# EAGLE design M163X (EAGLE 6.6.0)
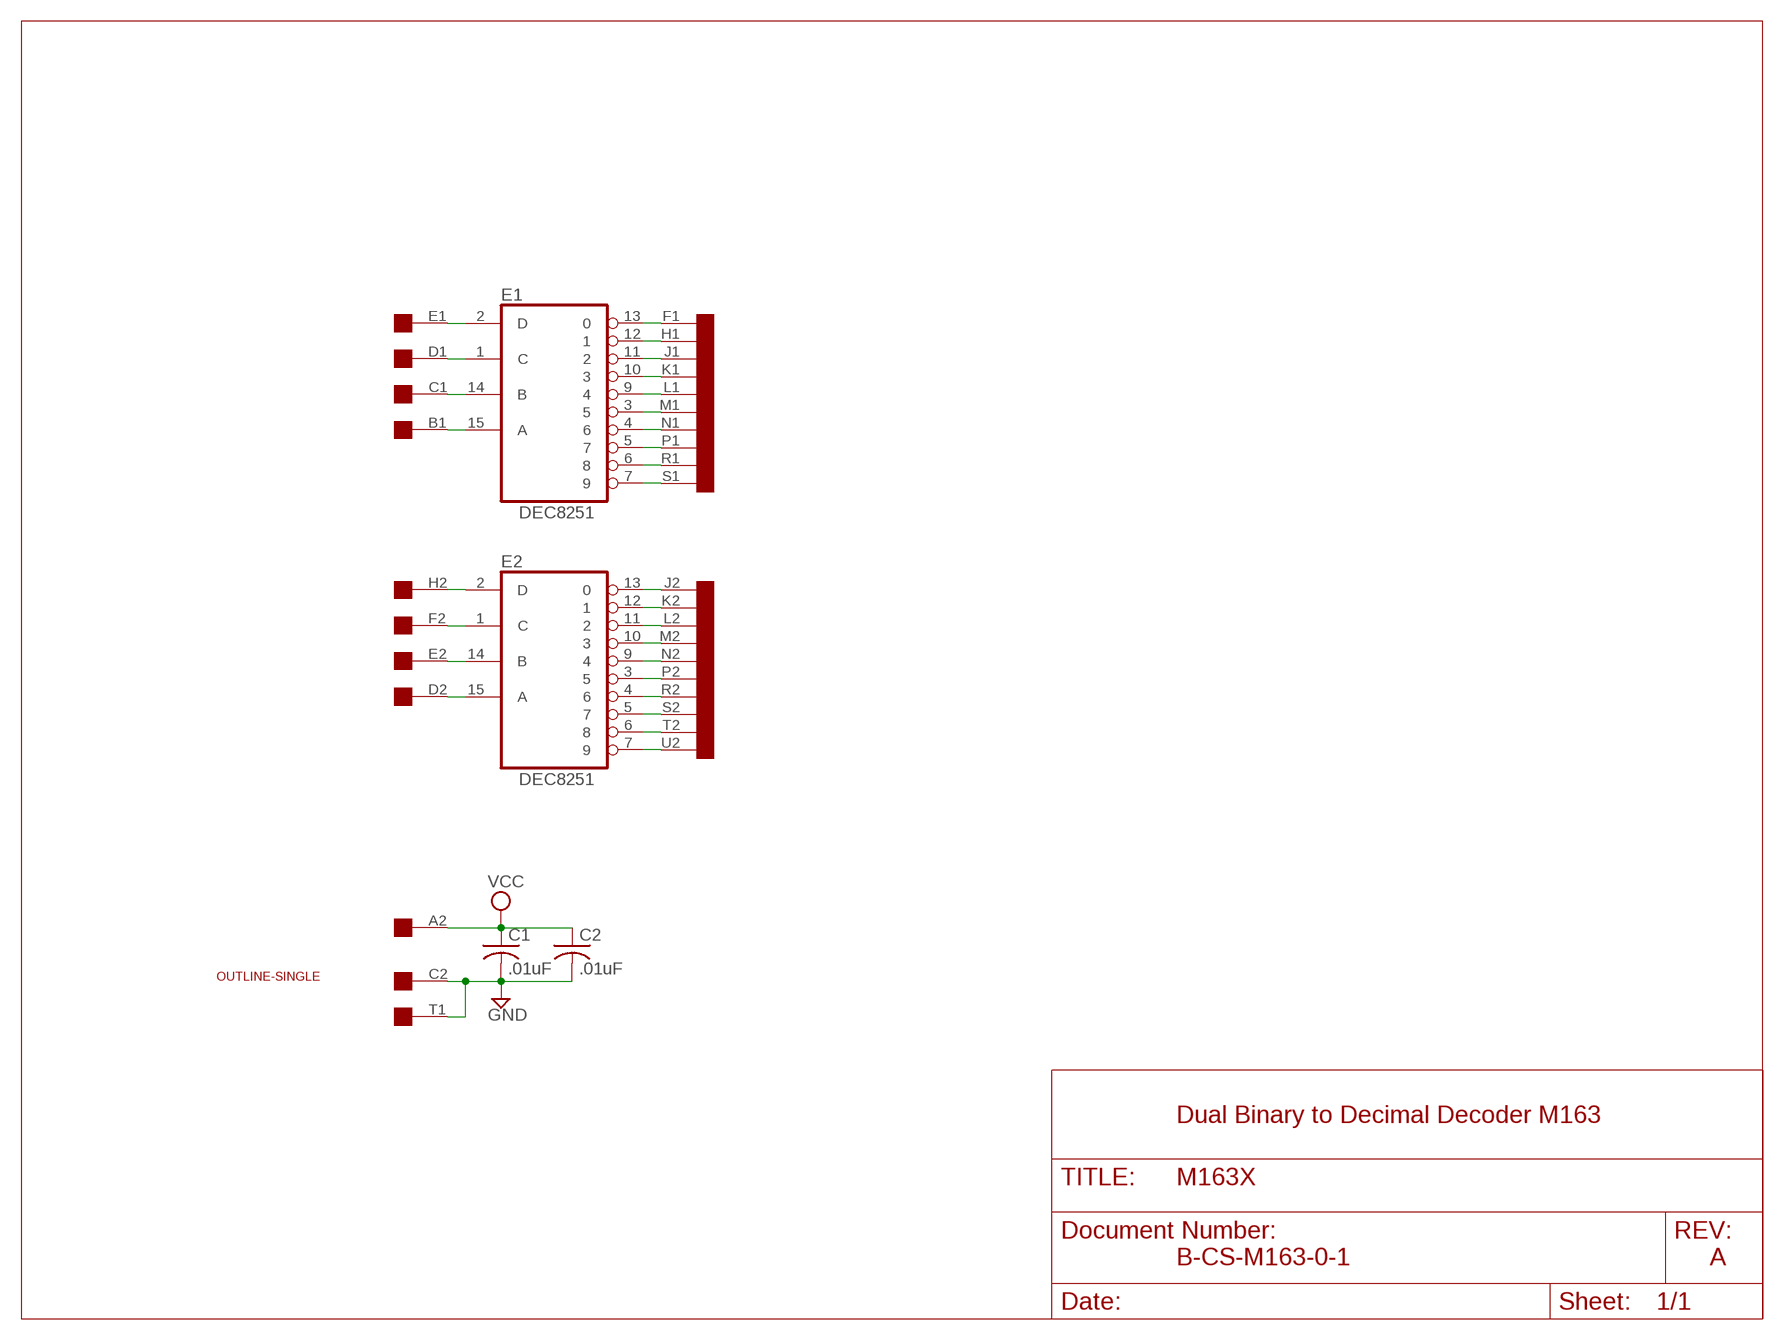
[diagram p0: schematic, sheet 1]

## Parts
C1  .01uF  C-US050-025X075  [C050-025X075]
C2  .01uF  C-US050-025X075  [C050-025X075]
E1  DEC8251  [DIL16]
E2  DEC8251  [DIL16]
U$1  OUTLINE-SINGLE  [SINGLE]
U$2  SINGLE  [EDGE-CON2]

## Nets
GND [supply]: C1.2 C2.2 U$2.C2 U$2.T1
N$1: E1.15(A) U$2.B1
N$2: E1.14(B) U$2.C1
N$3: E1.1(C) U$2.D1
N$4: E1.2(D) U$2.E1
N$5: E1.13 U$2.F1
N$6: E1.12 U$2.H1
N$7: E1.11 U$2.J1
N$8: E1.10 U$2.K1
N$9: E1.3 U$2.M1
N$10: E1.9 U$2.L1
N$11: E1.4 U$2.N1
N$12: E1.5 U$2.P1
N$13: E1.6 U$2.R1
N$14: E1.7 U$2.S1
N$15: E2.2(D) U$2.H2
N$16: E2.1(C) U$2.F2
N$17: E2.15(A) U$2.D2
N$18: E2.14(B) U$2.E2
N$19: E2.11 U$2.L2
N$20: E2.10 U$2.M2
N$21: E2.9 U$2.N2
N$22: E2.3 U$2.P2
N$23: E2.4 U$2.R2
N$24: E2.5 U$2.S2
N$25: E2.6 U$2.T2
N$26: E2.12 U$2.K2
N$27: E2.13 U$2.J2
N$28 [supply]: E2.7 U$2.U2
VCC [supply]: C1.1 C2.1 U$2.A2
Unconnected: U$2.A1 U$2.B2 U$2.U1 U$2.V1 U$2.V2

## Notes on the sheet
- Dual Binary to Decimal Decoder M163
- B-CS-M163-0-1 | A

## Power pins joined to a net without a drawn wire
GND: E1.8(GND) E2.8(GND)
VCC: E1.16(VCC) E2.16(VCC)

## Library data of the parts
C1 C2 = rcl:C-US: CAPACITOR, American symbol
E1 E2 = dec-con:DEC8251: BCD Decoder
U$1 = dec-con:OUTLINE-*: Board outlines for DEC boards.
U$2 = dec-con:SINGLE: Single-Height DEC board

## Net classes
1 supply: width 0.813 mm

## Board
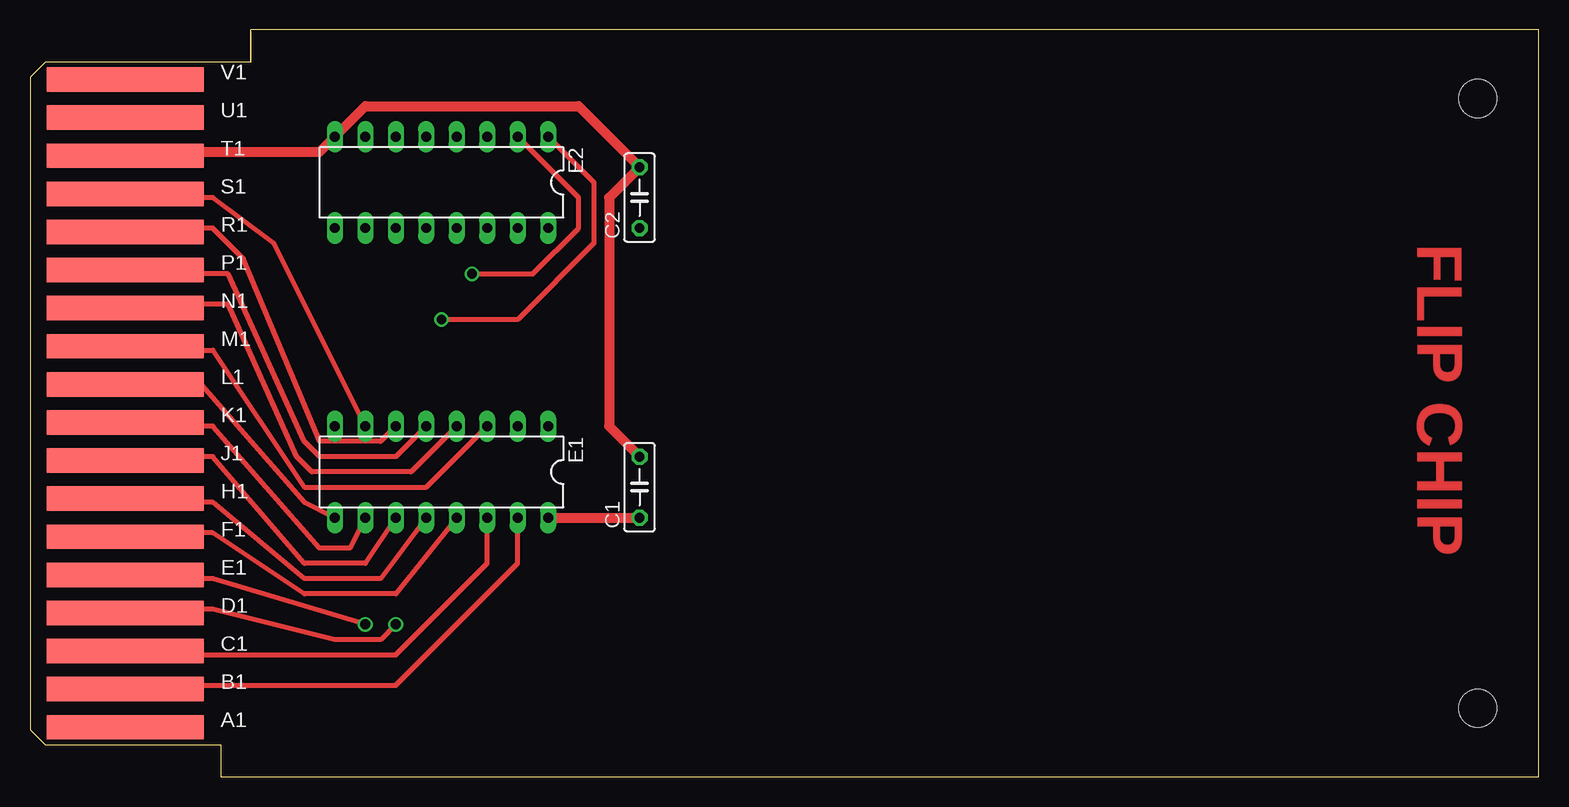
[diagram p1: board, top side]
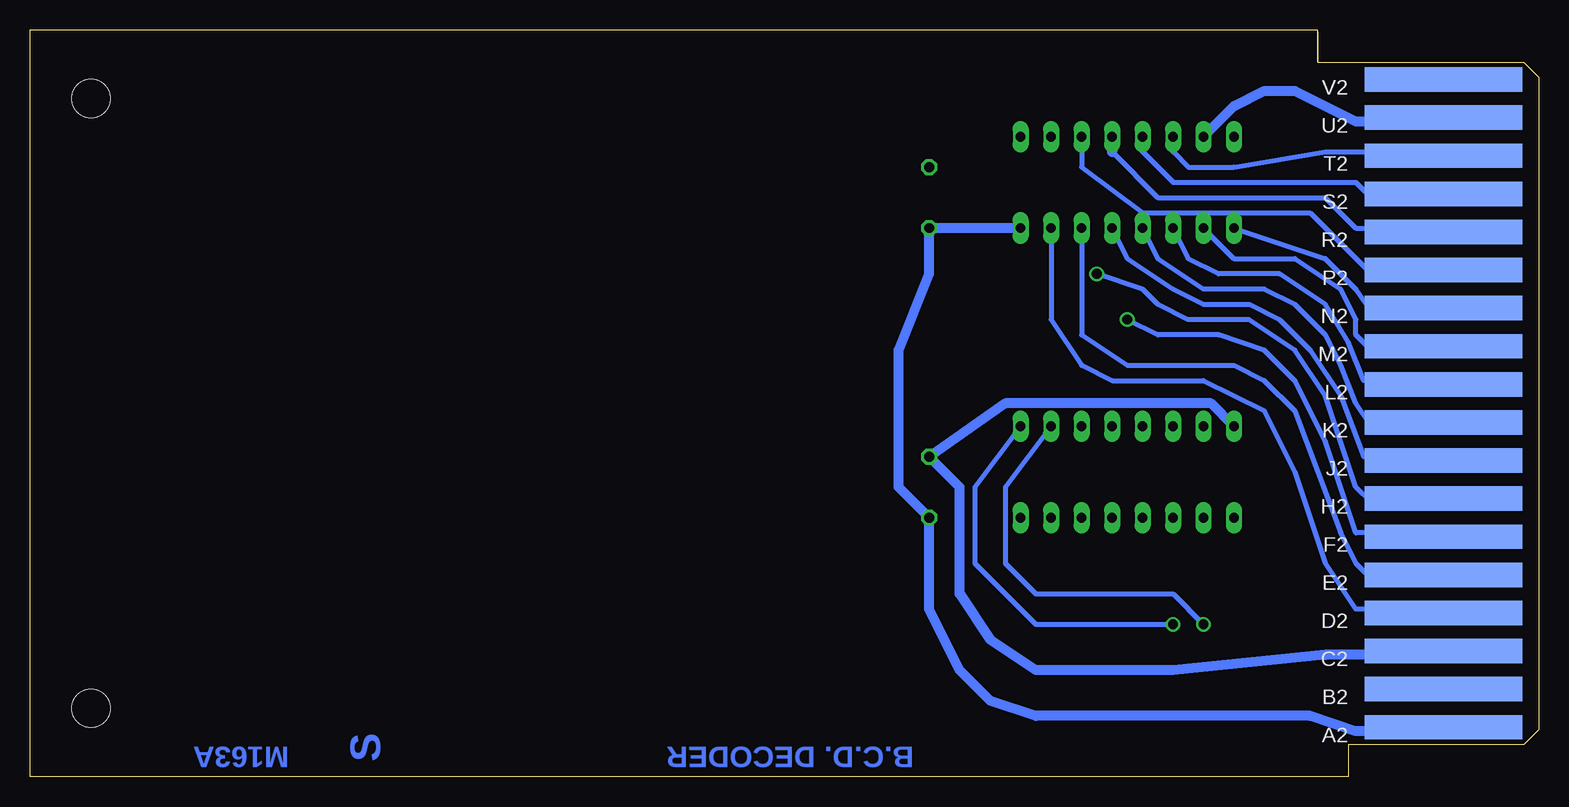
[diagram p2: board, bottom side, seen from below]

Size 125.73 x 62.23 mm. Coordinates in mm from the lower left corner, seen from the top.
Copper layers (1+16): Top 0.035mm / dielectric 1.5mm / Bottom 0.035mm
Design rules "16mils": minimum track width 16mil, minimum drill 32mil, track to track 15mil, track to pad 10mil, pad to pad 10mil, via to via 10mil, smd to smd 10mil, copper to edge 13mil, drill to drill 10mil, minimum pad ring 10mil, minimum via ring 8mil, stop-mask expansion 0mil, vias tented up to drill 0mil, thermal gap 10mil

### Footprints (pad centres in the part's own frame; a part is rotated, then mirrored left to right if it is on the bottom)
C050-025X075 = drill 0.813 octagon: 1 -2.54,0; 2 2.54,0
DIL16 = drill 0.813 long: 1 -8.89,-3.81; 2 -6.35,-3.81; 3 -3.81,-3.81; 4 -1.27,-3.81; 5 1.27,-3.81; 6 3.81,-3.81; 7 6.35,-3.81; 8 8.89,-3.81; 9 8.89,3.81; 10 6.35,3.81; 11 3.81,3.81; 12 1.27,3.81; 13 -1.27,3.81; 14 -3.81,3.81; 15 -6.35,3.81; 16 -8.89,3.81
SINGLE = hole 3.175: 120.65,56.515; 120.65,5.715
EDGE-CON2 = smd 13.106 x 2.032: A1 7.938,4.128; B1 7.938,7.303; C1 7.938,10.477; D1 7.938,13.652; E1 7.938,16.828; F1 7.938,20.003; H1 7.938,23.177; J1 7.938,26.352; K1 7.938,29.527; L1 7.938,32.703; M1 7.938,35.877; N1 7.938,39.053; P1 7.938,42.227; R1 7.938,45.403; S1 7.938,48.578; T1 7.938,51.752; U1 7.938,54.928; V1 7.938,58.102 | smd 13.106 x 2.032 bottom: A2 7.938,4.128; B2 7.938,7.303; C2 7.938,10.477; D2 7.938,13.652; E2 7.938,16.828; F2 7.938,20.003; H2 7.938,23.177; J2 7.938,26.352; K2 7.938,29.527; L2 7.938,32.703; M2 7.938,35.877; N2 7.938,39.053; P2 7.938,42.227; R2 7.938,45.403; S2 7.938,48.578; T2 7.938,51.752; U2 7.938,54.928; V2 7.938,58.102

### Placement (x,y rotation side)
C1  50.8,24.13 90 top
C2  50.8,48.26 90 top
E1  34.29,25.4 180 top
E2  34.29,49.53 180 top
U$1  0,0 0 top
U$2  0,0 0 top

### Tracks (layer width: path | path; a pad name or v marks a point on that pad's centre or on a via)
GND
  Top 0.813: C1.2 48.26,29.21 48.26,48.26 C2.2 45.72,55.88 27.94,55.88 E2.8 24.13,52.07 10.16,52.07 U$2.T1
  Bottom 0.813: U$2.C2 10.16,10.16 17.78,10.16 30.48,8.89 41.91,8.89 45.72,11.43 48.26,15.24 48.26,24.13 C1.2 44.45,31.11 27.31,31.11 E1.8
N$1
  Top 0.406: U$2.B1 11.43,7.62 30.48,7.62 40.64,17.78 E1.15
N$2
  Top 0.406: U$2.C1 8.89,10.16 30.48,10.16 38.1,17.78 E1.14
N$3  (via drill 0.81)
  Top 0.406: v30.48,12.7 29.21,11.43 25.4,11.43 15.24,13.97 8.89,13.97 U$2.D1
  Bottom 0.406: E1.1 46.99,24.13 46.99,17.78 41.91,12.7 v30.48,12.7
N$4  (via drill 0.81)
  Top 0.406: v27.94,12.7 15.24,16.51 8.89,16.51 U$2.E1
  Bottom 0.406: E1.2 44.45,24.13 44.45,17.78 41.91,15.24 30.48,15.24 v27.94,12.7
N$5
  Top 0.406: E1.13 30.48,15.24 22.86,15.24 15.24,20.32 8.89,20.32 U$2.F1
N$6
  Top 0.406: E1.12 29.21,16.51 22.86,16.51 15.24,22.86 8.89,22.86 U$2.H1
N$7
  Top 0.406: E1.11 27.94,17.78 22.86,17.78 15.24,26.67 8.89,26.67 U$2.J1
N$8
  Top 0.406: E1.10 26.67,19.05 24.13,19.05 15.24,29.21 8.89,29.21 U$2.K1
N$9
  Top 0.406: U$2.M1 10.16,35.56 15.24,35.56 22.86,24.13 33.02,24.13 E1.3
N$10
  Top 0.406: U$2.L1 8.89,33.02 13.97,33.02 22.86,22.86 E1.9
N$11
  Top 0.406: E1.4 31.75,25.4 23.5,25.4 22.23,26.67 16.51,39.37 8.89,39.37 U$2.N1
N$12
  Top 0.406: E1.5 30.48,26.67 24.13,26.67 22.86,27.94 16.51,41.91 8.89,41.91 U$2.P1
N$13
  Top 0.406: E1.6 29.21,27.94 24.13,27.94 17.78,43.18 15.24,45.72 8.89,45.72 U$2.R1
N$14
  Top 0.406: E1.7 20.32,44.45 15.24,48.26 8.89,48.26 U$2.S1
N$15  (via drill 0.81)
  Top 0.406: v36.83,41.91 41.91,41.91 45.72,45.72 45.72,48.26 E2.2
  Bottom 0.406: U$2.H2 8.89,22.86 13.97,22.86 15.24,24.13 17.78,31.75 20.32,35.56 24.13,38.1 29.21,38.1 31.75,39.37 33.02,40.64 v36.83,41.91
N$16  (via drill 0.81)
  Top 0.406: E2.1 46.99,49.53 46.99,44.45 40.64,38.1 v34.29,38.1
  Bottom 0.406: U$2.F2 8.89,20.32 15.24,20.32 17.78,27.94 20.32,33.02 22.86,35.56 26.67,36.83 31.75,36.83 v34.29,38.1
N$17
  Bottom 0.406: E2.15 40.64,38.1 38.1,34.29 35.56,33.02 27.94,33.02 22.86,30.48 20.32,25.4 17.78,17.78 15.24,13.97 8.89,13.97 U$2.D2
N$18
  Bottom 0.406: E2.14 38.1,36.83 34.29,34.29 25.4,34.29 22.86,33.02 20.32,30.48 16.51,20.32 15.24,17.78 13.97,16.51 8.89,16.51 U$2.E2
N$19
  Bottom 0.406: U$2.L2 10.16,33.02 14.61,33.02 15.88,36.2 17.78,39.37 21.59,41.91 26.67,41.91 29.21,43.18 E2.11
N$20
  Bottom 0.406: E2.10 25.4,43.18 20.32,43.18 16.51,40.64 15.24,38.1 15.24,36.83 13.97,35.56 10.16,35.56 U$2.M2
N$21
  Bottom 0.406: E2.9 17.78,43.18 15.24,40.64 13.97,38.73 12.7,39.37 8.89,39.37 U$2.N2
N$22
  Bottom 0.406: E2.3 38.1,50.8 33.02,46.99 19.05,46.99 13.97,41.91 8.89,41.91 U$2.P2
N$23
  Bottom 0.406: 35.56,52.07 31.75,48.26 17.78,48.26 15.24,45.72 8.89,45.72 U$2.R2
  Bottom 0.813: E2.4 35.56,52.07
N$24
  Bottom 0.406: E2.5 33.02,52.07 30.48,49.53 15.24,49.53 13.97,48.26 8.89,48.26 U$2.S2
N$25
  Bottom 0.406: E2.6 30.48,52.07 29.21,50.8 25.4,50.8 17.78,52.07 8.89,52.07 U$2.T2
N$26
  Bottom 0.406: U$2.K2 10.16,29.21 13.97,29.21 15.24,31.11 16.51,34.29 17.78,36.83 20.32,39.37 22.86,40.64 27.94,40.64 31.75,43.18 E2.12
N$27
  Bottom 0.406: E2.13 34.29,43.18 30.48,40.64 27.94,39.37 24.13,39.37 21.59,38.1 19.05,35.56 16.51,31.75 14.61,26.67 8.89,26.67 U$2.J2
N$28
  Bottom 0.813: E2.7 25.4,55.88 22.86,57.15 20.32,57.15 15.24,54.61 8.89,54.61 U$2.U2
VCC
  Top 0.813: E1.16 C1.1
  Bottom 0.813: U$2.A2 8.26,3.81 15.24,3.81 19.05,5.08 41.91,5.08 45.72,6.35 48.26,8.89 50.8,13.97 C1.1 53.34,24.13 53.34,35.56 50.8,41.91 C2.1 E2.16

### Text on the board
Top: FLIP CHIP
Bottom: B.C.D. DECODER | M163A | S